# EAGLE schematic hub_interior (EAGLE 7.6.0)
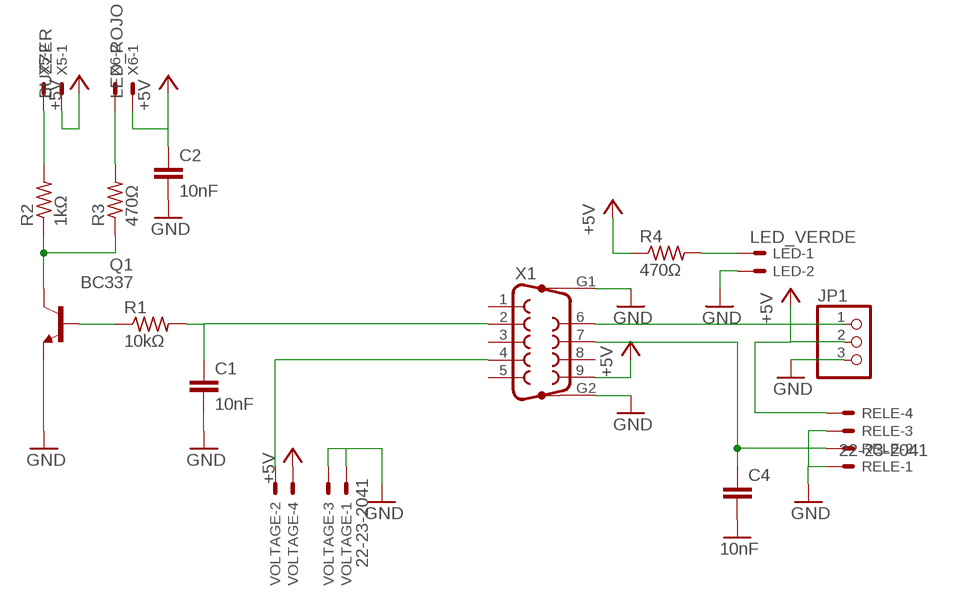
[diagram p0: schematic, sheet 1]

## Parts
C1  10nF  C-EU050-025X075  [C050-025X075]
C2  10nF  C-EU050-025X075  [C050-025X075]
C4  C-EU050-025X075  [C050-025X075]
JP1  PINHD-1X3  [1X03]
LED  LED_VERDE  22-23-2021  [22-23-2021]
Q1  BC337  [TO92]
R1  10kΩ  R-US_0207/7  [0207/7]
R2  1kΩ  R-US_0207/7  [0207/7]
R3  470Ω  R-US_0207/7  [0207/7]
R4  470Ω  R-US_0207/7  [0207/7]
RELE  22-23-2041  [22-23-2041]
VOLTAGE  22-23-2041  [22-23-2041]
X1  F09HP  [F09HP]
X5  BUZZER  22-23-2021  [22-23-2021]
X6  LED_ROJO  22-23-2021  [22-23-2021]

## Nets
+5V: C2.1 JP1.2 R4.1 RELE.4 VOLTAGE.4 X1.9 X5.1 X6.1
GND: C1.2 C2.2 C4.2 JP1.3 LED.2 Q1.1(E) RELE.1 RELE.3 VOLTAGE.1 VOLTAGE.3 X1.G1 X1.G2 ; supply symbol labelled 10nF
N$1: Q1.2(B) R1.1
N$2: C1.1 R1.2 X1.2
N$3: Q1.3(C) R2.1 R3.1
N$4: C4.1 RELE.2 X1.7
N$5: R2.2 X5.2
N$6: R3.2 X6.2
N$7: LED.1 R4.2
N$10: VOLTAGE.2 X1.4
N$13: JP1.1 X1.6
Unconnected: X1.1 X1.3 X1.5 X1.8

## Library data of the parts
C1 C2 C4 = rcl:C-EU: CAPACITOR, European symbol
JP1 = pinhead:PINHD-1X3: PIN HEADER
LED X5 X6 = con-molex:22-23-2021: .100" (2.54mm) Center Header - 2 Pin; MF: MOLEX; MPN: 22-23-2021; OC_FARNELL: 1462926; OC_NEWARK: 25C3832
Q1 = transistor-npn:BC337*: NPN Transistor
R1-R4 = rcl:R-US_: RESISTOR, American symbol
RELE VOLTAGE = con-molex:22-23-2041: .100" (2.54mm) Center Header - 4 Pin; MF: MOLEX; MPN: 22-23-2041; OC_FARNELL: 1462920; OC_NEWARK: 38C0355
X1 = con-subd:F09HP: SUB-D; OC_FARNELL: unknown; OC_NEWARK: unknown